# EAGLE design usbHub (EAGLE 9.5.2)
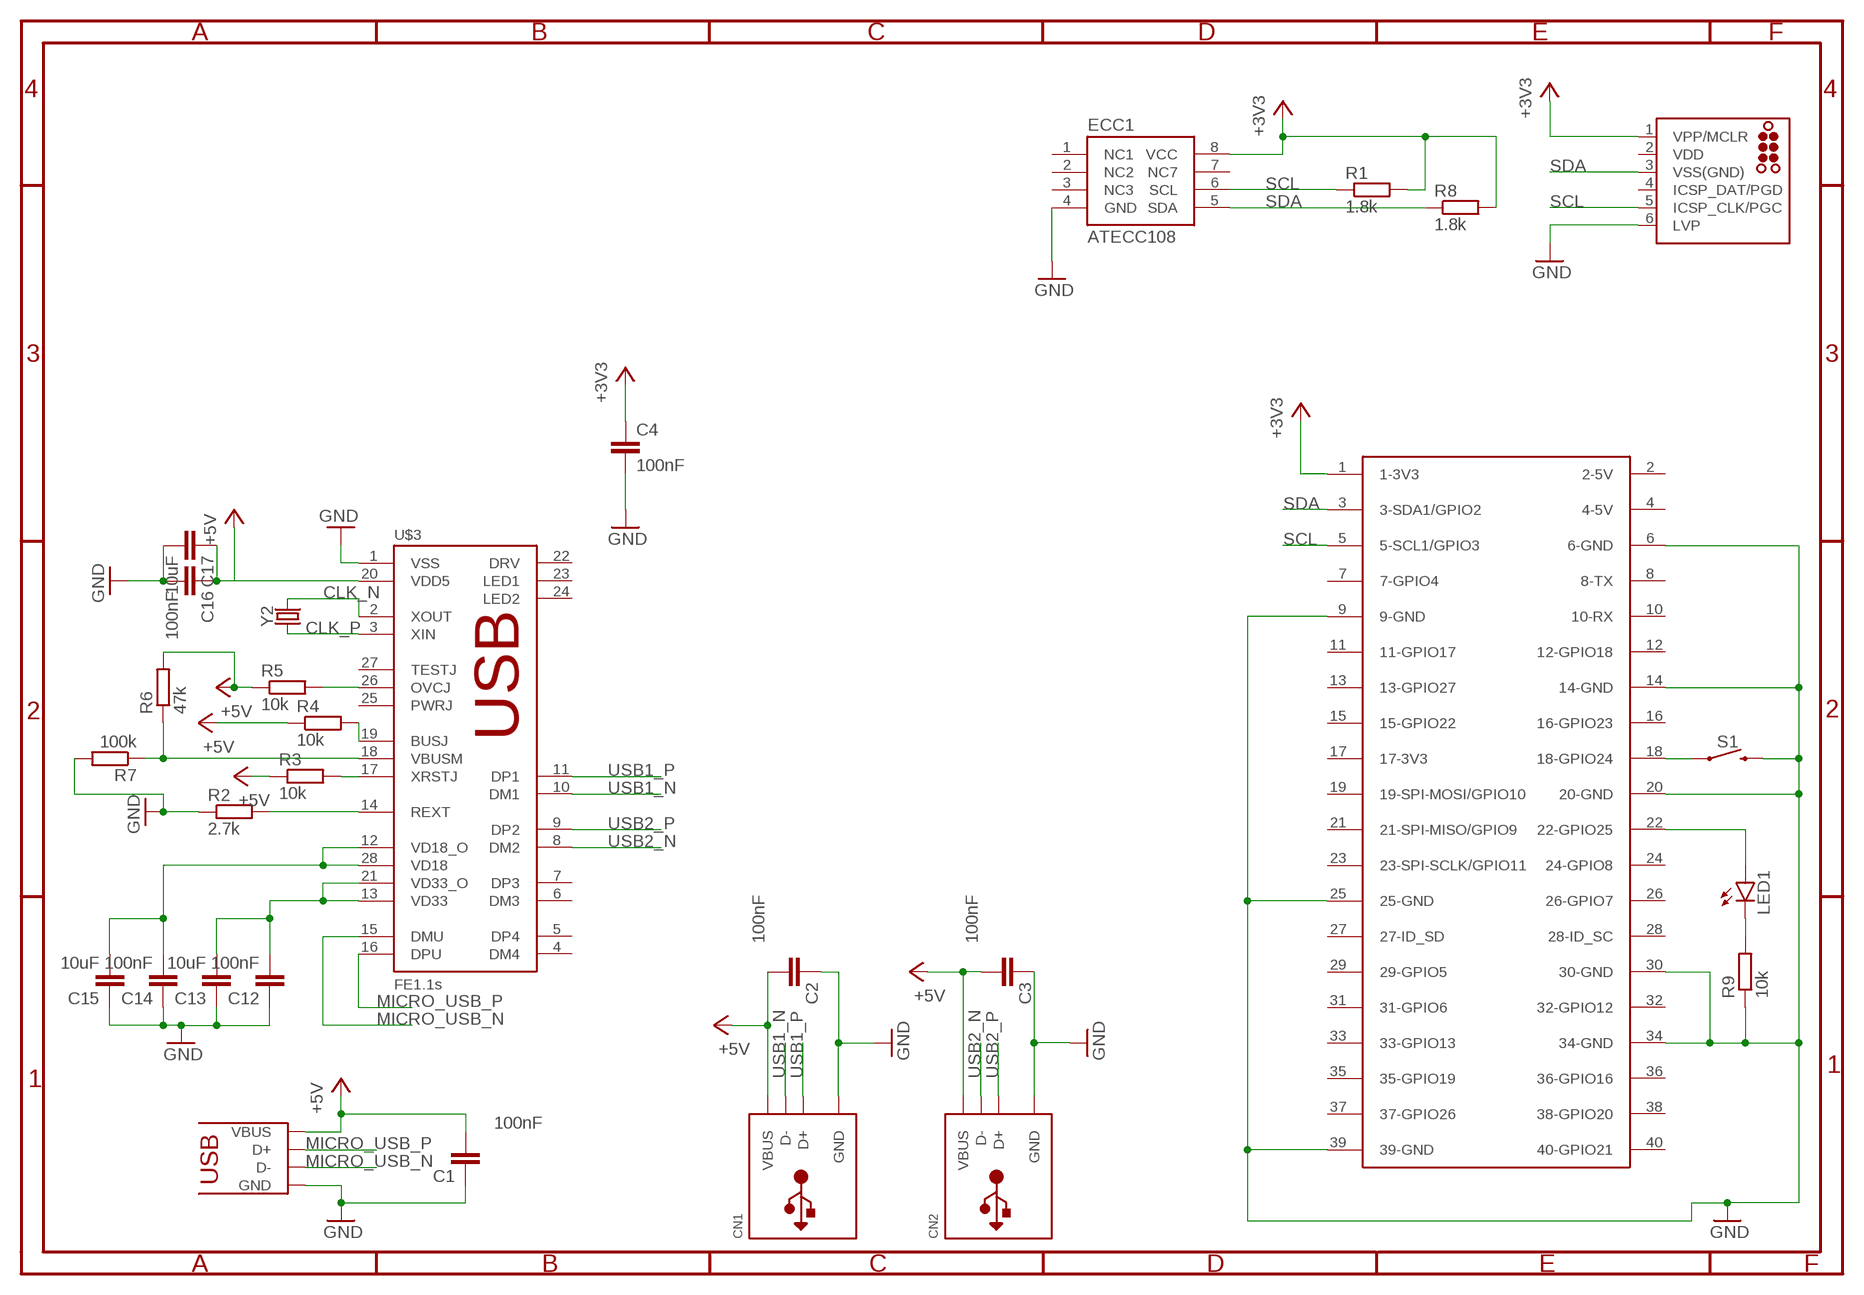
[diagram p0: schematic, sheet 1]

## Parts
C1  100nF  C-EUC0603  [C0603]
C2  100nF  C-EUC0603  [C0603]
C3  100nF  C-EUC0603  [C0603]
C4  100nF  C-EUC0603  [C0603]
C12  100nF  C-EUC0603  [C0603]
C13  10uF  C-EUC0603  [C0603]
C14  100nF  C-EUC0603  [C0603]
C15  10uF  C-EUC0603  [C0603]
C16  100nF  C-EUC0603  [C0603]
C17  10uF  C-EUC0603  [C0603]
CN1  USB_TYPEAPTHFML  [USB_HOST-PTH]
CN2  USB_TYPEAPTHFML  [USB_HOST-PTH]
ECC1  ATECC108  [SO08]
J1  TC2030-MCP-NL  [TC2030-MCP-NL]
LED1  LEDCHIPLED_0603  [CHIPLED_0603]
R1  1.8k  R-EU_R0603  [R0603]
R2  2.7k  R-EU_R0603  [R0603]
R3  10k  R-EU_R0603  [R0603]
R4  10k  R-EU_R0603  [R0603]
R5  10k  R-EU_R0603  [R0603]
R6  47k  R-EU_R0603  [R0603]
R7  100k  R-EU_R0603  [R0603]
R8  1.8k  R-EU_R0603  [R0603]
R9  10k  R-EU_R0603  [R0603]
S1  MOMENTARY-SWITCH-SPST-SMD-6.2MM-TALL  [TACTILE_SWITCH_SMD_6.2MM_TALL]
U$1  USB-MICROB  [USB-MICROB]
U$3  FE1.1S  [FE1.1S_SSOP-28]
U$4  RASPBERRY-PI+HEADERONLY  [RASPBERRY-PI-PLUS-HEADERONLY]
Y2  12mHZ  CRYSTALSMD-HC49UP  [HC49UP]

## Nets
+3V3: C4.1 ECC1.8(VCC) J1.1(VPP/MCLR) R1.2 R8.2 U$4.1(1-3V3)
+5V: C1.2 C2.2 C3.2 C16.1 C17.1 CN1.VBUS CN2.VBUS R3.1 R4.1 R5.1 R6.2 U$1.VBUS U$3.20(VDD5)
CLK_N: U$3.2(XOUT) Y2.2
CLK_P: U$3.3(XIN) Y2.1
GND: C1.1 C2.1 C3.1 C4.2 C12.1 C13.1 C14.1 C15.1 C16.2 C17.2 CN1.GND CN2.GND ECC1.4(GND) J1.6(LVP) R2.1 R7.2 R9.1 S1.B2 U$1.GND U$1.MT1(GND) U$1.MT2(GND) U$1.P$1(GND) U$1.P$2(GND) U$1.P$3(GND) U$1.P$4(GND) U$3.1(VSS) U$4.6(6-GND) U$4.9(9-GND) U$4.14(14-GND) U$4.20(20-GND) U$4.25(25-GND) U$4.30(30-GND) U$4.34(34-GND) U$4.39(39-GND)
MICRO_USB_N: U$1.D- U$3.15(DMU)
MICRO_USB_P: U$1.D+ U$3.16(DPU)
N$1: LED1.A U$4.22(22-GPIO25)
N$3: S1.A2 U$4.18(18-GPIO24)
N$5: LED1.C R9.2
N$11: C12.2 C13.2 U$3.13(VD33) U$3.21(VD33_O)
N$12: C14.2 C15.2 U$3.12(VD18_O) U$3.28(VD18)
N$19: R5.2 U$3.26(OVCJ)
N$20: R2.2 U$3.14(REXT)
N$21: R4.2 U$3.19(BUSJ)
N$22: R6.1 R7.1 U$3.18(VBUSM)
N$24: R3.2 U$3.17(XRSTJ)
SCL: ECC1.6(SCL) J1.5(ICSP_CLK/PGC) R1.1 U$4.5(5-SCL1/GPIO3)
SDA: ECC1.5(SDA) J1.3(VSS(GND)) R8.1 U$4.3(3-SDA1/GPIO2)
USB1_N: CN1.D- U$3.10(DM1)
USB1_P: CN1.D+ U$3.11(DP1)
USB2_N: CN2.D- U$3.8(DM2)
USB2_P: CN2.D+ U$3.9(DP2)
Unconnected: ECC1.1(NC1) ECC1.2(NC2) ECC1.3(NC3) ECC1.7(NC7) J1.4(ICSP_DAT/PGD) U$3.4(DM4) U$3.5(DP4) U$3.6(DM3) U$3.7(DP3) U$3.22(DRV) U$3.23(LED1) U$3.24(LED2) U$3.25(PWRJ) U$3.27(TESTJ) U$4.2(2-5V) U$4.4(4-5V) U$4.7(7-GPIO4) U$4.8(8-TX) U$4.10(10-RX) U$4.11(11-GPIO17) U$4.12(12-GPIO18) U$4.13(13-GPIO27) U$4.15(15-GPIO22) U$4.16(16-GPIO23) U$4.17(17-3V3) U$4.19(19-SPI-MOSI/GPIO10) U$4.21(21-SPI-MISO/GPIO9) U$4.23(23-SPI-SCLK/GPIO11) U$4.24(24-GPIO8) U$4.26(26-GPIO7) U$4.27(27-ID_SD) U$4.28(28-ID_SC) U$4.29(29-GPIO5) U$4.31(31-GPIO6) U$4.32(32-GPIO12) U$4.33(33-GPIO13) U$4.35(35-GPIO19) U$4.36(36-GPIO16) U$4.37(37-GPIO26) U$4.38(38-GPIO20) U$4.40(40-GPIO21)

## Notes on the sheet
- USB

## Power pins joined to a net without a drawn wire
VDD: J1.2(VDD)

## Library data of the parts
C1-C4 C12-C17 = resistor:C-EU: CAPACITOR, European symbol
CN1 CN2 = microbuilder:USB_TYPEA: USB - Type A Connectors Male types stick out and are inserted into a PC or matching females parts (these are the connectors used on USB Memory Sticks, etc.). Female parts are generally used for USB Host and accept a male-type connector. SMT Male - 4UCON: 10017 PTH Female - Digikey: 609-1045-ND, 4UCon: 05241
ECC1 = SparkFun-IC-Special-Function:ATECC108: ATECC108 ECDSA with NIST ATECC108: Provides ECDSA with NIST curves P256, B283, and K283. Also, a RNG, 8.5Kb EEPROM. 2.0V - 5.5V. Datasheet <https://cdn.sparkfun.com/datasheets/Dev/Beagle/Atmel-8873S-CryptoAuth-ATECC108-Datasheet-Summary.pdf> SparkFun Products CryptoCape <https://www.sparkfun.com/products/12773> (DEV-12773) SparkFun CryptoShield <https://www.sparkfun.com/products/13183> (DEV-13183); PROD_ID: IC-11982
J1 = tag-connect:TC2030: TAG-CONNECT ICSP Connector Manufacturer: Tag-Connect <http://www.tag-connect.com> Cable for easy In-Circuit Serial Programming. Designed for Microchip ICD2, suitable for many others. Two variants - one "with legs" (for hands-free fit on PCB) and another "without legs" for quick programming. PAD Description 1 MCLR/Vpp 2 Vdd 3 GND 4 PGD (ISPDAT) 5 PGC (ISPCLK) 6 nc (used for LVP) ©2009 ROFA.cz - modified and updated by Robert Darlington ‹rdarlington@gmail.com›
LED1 = led:LED: LED OSRAM: - CHIPLED LG R971, LG N971, LY N971, LG Q971, LY Q971, LO R971, LY R971 LH N974, LH R974 LS Q976, LO Q976, LY Q976 LO Q996 - Hyper CHIPLED LW Q18S LB Q993, LB Q99A, LB R99A - SideLED LS A670, LO A670, LY A670, LG A670, LP A670 LB A673, LV A673, LT A673, LW A673 LH A674 LY A675 LS A676, LA A676, LO A676, LY A676, LW A676 LS A679, LY A679, LG A679 - Hyper Micro SIDELED® LS Y876, LA Y876, LO Y876, LY Y876 LT Y87S - SmartLED LW L88C, LW L88S LB L89C, LB L89S, LG L890 LS L89K, LO L89K, LY L89K LS L896, LA L896, LO L896, LY L896 - TOPLED LS T670, LO T670, LY T670, LG T670, LP T670 LSG T670, LSP T670, LSY T670, LOP T670, LYG T670 LG T671, LOG T671, LSG T671 LB T673, LV T673, LT T673, LW T673 LH T674 LS T676, LA T676, LO T676, LY T676, LB T676, LH T676, LSB T676, LW T676 LB T67C, LV T67C, LT T67C, LS T67K, LO T67K, LY T67K, LW E67C LS E67B, LA E67B, LO E67B, LY E67B, LB E67C, LV E67C, LT E67C LW T67C LS T679, LY T679, LG T679 LS T770, LO T770, LY T770, LG T770, LP T770 LB T773, LV T773, LT T773, LW T773 LH T774 LS E675, LA E675, LY E675, LS T675 LS T776, LA T776, LO T776, LY T776, LB T776 LHGB T686 LT T68C, LB T68C - Hyper Mini TOPLED® LB M676 - Mini TOPLED Santana® LG M470 LS M47K, LO M47K, LY M47K Source: http://www.osram.convergy.de LUXEON: - LUMILED® LXK2-PW12-R00, LXK2-PW12-S00, LXK2-PW14-U00, LXK2-PW14-V00 LXK2-PM12-R00, LXK2-PM12-S00, LXK2-PM14-U00 LXK2-PE12-Q00, LXK2-PE12-R00, LXK2-PE12-S00, LXK2-PE14-T00, LXK2-PE14-U00 LXK2-PB12-K00, LXK2-PB12-L00, LXK2-PB12-M00, LXK2-PB14-N00, LXK2-PB14-P00, LXK2-PB14-Q00 LXK2-PR12-L00, LXK2-PR12-M00, LXK2-PR14-Q00, LXK2-PR14-R00 LXK2-PD12-Q00, LXK2-PD12-R00, LXK2-PD12-S00 LXK2-PH12-R00, LXK2-PH12-S00 LXK2-PL12-P00, LXK2-PL12-Q00, LXK2-PL12-R00 Source: www.luxeon.com KINGBRIGHT: KA-3528ASYC Source: www.kingbright.com
R1-R9 = resistor:R-EU_: RESISTOR, European symbol
S1 = SparkFun-Switches:MOMENTARY-SWITCH-SPST: Momentary Switch (Pushbutton) - SPST Normally-open (NO) SPST momentary switches (buttons, pushbuttons). Variants PTH-12MM - 12mm square, through-hole Momentary Pushbutton Switch - 12mm Square <https://www.sparkfun.com/products/9190> (COM-09190) PTH-6.0MM, PTH-6.0MM-KIT - 6.0mm square, through-hole Mini Pushbutton Switch <https://www.sparkfun.com/products/97> (COM-00097) KIT package intended for soldering kit's - only one side of pads' copper is exposed. PTH-RIGHT-ANGLE-KIT - Right-angle, through-hole Right Angle Tactile Button <https://www.sparkfun.com/products/10791> - Used on SparkFun BigTime Watch Kit <https://www.sparkfun.com/products/11734> SMD-12MM - 12mm square, surface-mount Tactile Button - SMD (12mm) <https://www.sparkfun.com/products/12993> (COM-12993) Used on SparkFun PicoBoard <https://www.sparkfun.com/products/11888> SMD-4.5MM - 4.5mm Square Trackball Switch Used on SparkFun Blackberry Trackballer Breakout <https://www.sparkfun.com/products/13169> SMD-4.6MMX2.8MM - 4.60mm x 2.80mm, surface mount Used on SparkFun SAMD21 Mini Breakout <https://www.sparkfun.com/products/13664> SMD-5.2MM, SMD-5.2-REDUNDANT - 5.2mm square, surface-mount Mini Pushbutton Switch - SMD <https://www.sparkfun.com/products/8720> (COM-08720) Used on Arduino Pro Mini <https://www.sparkfun.com/products/11114> REDUNDANT package connects both switch circuits together SMD-6.0X3.5MM - 6.0 x 3.5mm, surface mount Momentary Reset Switch SMD <https://www.sparkfun.com/products/8229> (COM-08229) SMD-6.2MM-TALL - 6.2mm square, surface mount Tactile Button - SMD (6mm) <https://www.sparkfun.com/products/12992> Used on SparkFun Digital Sandbox <https://www.sparkfun.com/products/12651> SMD-RIGHT-ANGLE - Right-angle, surface mount Used on SparkFun Block for Intel® Edison - Arduino <https://www.sparkfun.com/products/13036>; PROD_ID: SWCH-11966; SF_SKU: COM-12992
U$1 = pimoroni:USB-MICROB
U$3 = Ai_IC:FE1.1S
U$4 = Ava2:RASPBERRY-PI+: Samtec SSW-120-01-T-D
Y2 = SparkFun-Clocks:CRYSTAL: Crystals (Generic) These are passive quartz crystals, which can be used as a clock source for a microcontroller. Crystal's are two-terminal devices. They require external "load" capacitors to generate an oscillating signal.

## Board
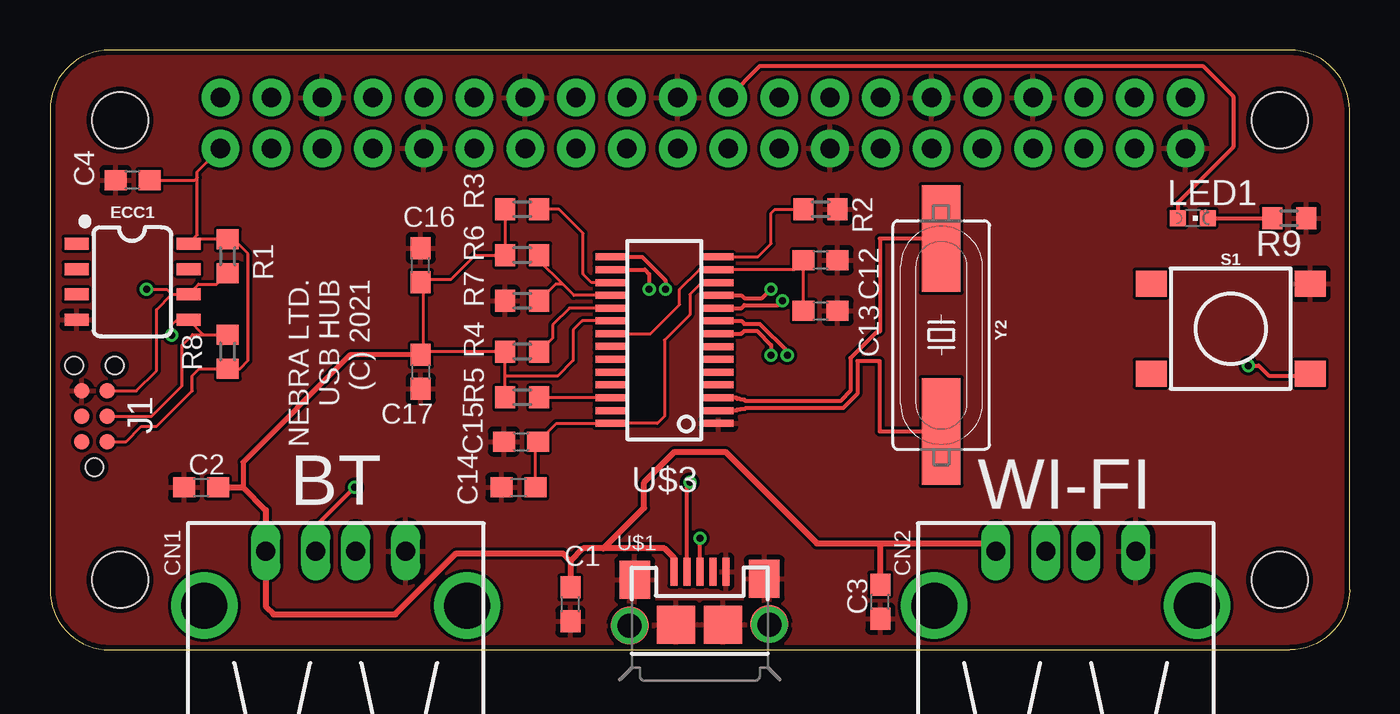
[diagram p1: board, top side]
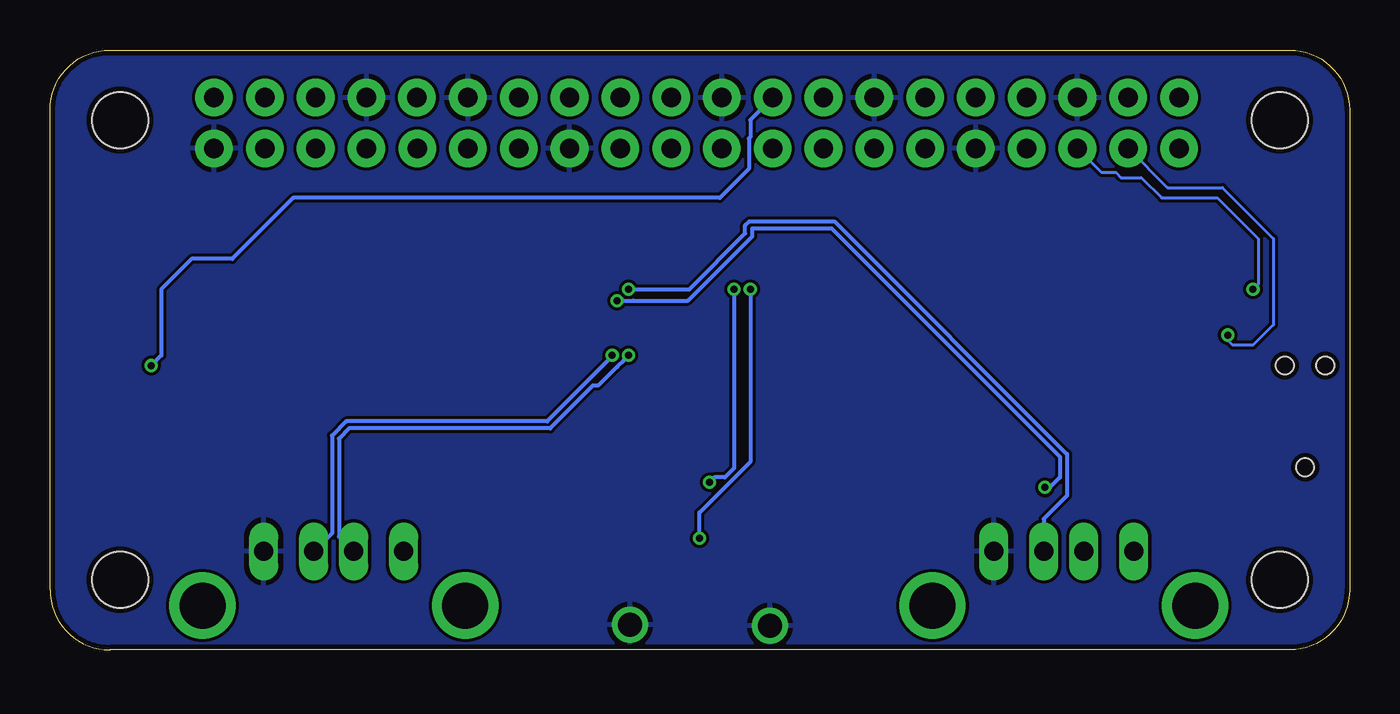
[diagram p2: board, bottom side, seen from below]

Size 65 x 30 mm. Coordinates in mm from the lower left corner, seen from the top.
Outline: 3,0 62,0 arc90 65,3 65,27 arc90 62,30 3,30 arc90 0,27 0,3 arc90 3,0
Copper layers (1*16): Top 0.035mm / dielectric 1.5mm / Bottom 0.035mm
Design rules "dirt_cheap_dirty_boards.v1.1": minimum track width 6mil, minimum drill 12mil, track to track 6mil, track to pad 6mil, pad to pad 6mil, via to via 6mil, smd to smd 0mil, copper to edge 10mil, drill to drill 10mil, minimum pad ring 10mil, minimum via ring 6mil, stop-mask expansion 2mil, vias tented up to drill 25mil, thermal gap 10mil
Holes 2.8 mm at 3.5,26.5 61.5,26.5 3.5,3.5 61.5,3.5

### Footprints (pad centres in the part's own frame; a part is rotated, then mirrored left to right if it is on the bottom)
C0603 = smd 1.1 x 1: 1 -0.85,0; 2 0.85,0
USB_HOST-PTH = drill 0.95 long: D+ 1,6.52; D- -1,6.52; GND 3.5,6.52; VBUS -3.5,6.52 | drill 2.3 pad 2.9: S1 -6.57,3.81; S2 6.57,3.81
SO08 = smd 0.6 x 1.2: 1 -1.905,-2.8; 2 -0.635,-2.8; 3 0.635,-2.8; 4 1.905,-2.8; 5 1.905,2.8; 6 0.635,2.8; 7 -0.635,2.8; 8 -1.905,2.8
TC2030-MCP-NL = smd 0.787 x 0.787: 1 1.27,-0.635; 2 1.27,0.635; 3 2.54,-0.635; 4 2.54,0.635; 5 3.81,-0.635; 6 3.81,0.635 | hole 0.889: 0,0; 5.08,-1.016; 5.08,1.016
CHIPLED_0603 = smd 0.8 x 0.8: A 0,-0.75; C 0,0.75
R0603 = smd 1 x 1.1: 1 -0.85,0; 2 0.85,0
TACTILE_SWITCH_SMD_6.2MM_TALL = smd 1.55 x 1.3: A1 -3.975,-2.25; A2 3.975,-2.25; B1 -3.975,2.25; B2 3.975,2.25
USB-MICROB = smd 0.35 x 1.4: D+ 0,2.65; D- -0.65,2.65; GND 1.3,2.65; ID 0.65,2.65; VBUS -1.3,2.65 | smd 1.546 x 1.9: MT1 -3.251,2.235; MT2 3.226,2.286 | smd 1.9 x 1.9: P$1 -1.194,0; P$2 1.168,0; P$5 -3.505,-0.051; P$6 3.48,0.025 | drill 1.2 pad 1.6: P$3 -3.505,-0.051; P$4 3.48,0
FE1.1S_SSOP-28 = smd 0.35 x 1.5: 1 -4.16,-2.7; 2 -3.52,-2.7; 3 -2.88,-2.7; 4 -2.24,-2.7; 5 -1.6,-2.7; 6 -0.96,-2.7; 7 -0.32,-2.7; 8 0.32,-2.7; 9 0.96,-2.7; 10 1.6,-2.7; 11 2.24,-2.7; 12 2.88,-2.7; 13 3.52,-2.7; 14 4.16,-2.7; 15 4.16,2.7; 16 3.52,2.7; 17 2.88,2.7; 18 2.24,2.7; 19 1.6,2.7; 20 0.96,2.7; 21 0.32,2.7; 22 -0.3,2.7; 23 -0.96,2.7; 24 -1.6,2.7; 25 -2.24,2.7; 26 -2.88,2.7; 27 -3.52,2.7; 28 -4.16,2.7
RASPBERRY-PI-PLUS-HEADERONLY = drill 0.97 pad 1.88: 1 -23.97,-1.218; 2 -23.97,1.323; 3 -21.43,-1.218; 4 -21.43,1.323; 5 -18.89,-1.218; 6 -18.89,1.323; 7 -16.35,-1.218; 8 -16.35,1.323; 9 -13.81,-1.218; 10 -13.81,1.323; 11 -11.27,-1.218; 12 -11.27,1.323; 13 -8.73,-1.218; 14 -8.73,1.323; 15 -6.19,-1.218; 16 -6.19,1.323; 17 -3.65,-1.218; 18 -3.65,1.323; 19 -1.11,-1.218; 20 -1.11,1.323; 21 1.43,-1.218; 22 1.43,1.323; 23 3.97,-1.218; 24 3.97,1.323; 25 6.51,-1.218; 26 6.51,1.323; 27 9.05,-1.218; 28 9.05,1.323; 29 11.59,-1.218; 30 11.59,1.323; 31 14.13,-1.218; 32 14.14,1.323; 33 16.67,-1.218; 34 16.67,1.323; 35 19.21,-1.218; 36 19.21,1.323; 37 21.75,-1.218; 38 21.75,1.323; 39 24.29,-1.218; 40 24.29,1.323
HC49UP = smd 5.334 x 1.93: 1 -4.826,0; 2 4.826,0

### Placement (x,y rotation side)
C1  26.04,2.28 90 top
C2  7.56,8.12 0 top
C3  41.53,2.41 90 top
C4  4.13,23.49 180 top
C12  38.55,19.49 180 top
C13  38.55,16.95 180 top
C14  23.43,8.12 0 top
C15  23.56,10.41 0 top
C16  18.54,19.24 90 top
C17  18.54,13.9 270 top
CN1  14.29,-1.59 0 top
CN2  50.8,-1.59 0 top
ECC1  4.13,18.41 270 top
J1  2.22,9.14 90 top
LED1  57.15,21.59 270 top
R1  8.89,19.68 90 top
R2  38.55,22.03 180 top
R3  23.62,22.03 0 top
R4  23.62,14.92 0 top
R5  23.62,12.63 0 top
R6  23.62,19.74 180 top
R7  23.62,17.46 180 top
R8  8.89,14.92 270 top
R9  61.98,21.59 180 top
S1  59.06,16.06 0 top
U$1  32.5,1.27 0 top
U$3  30.73,15.49 90 top
U$4  32.5,26.3 0 top
Y2  44.58,15.74 270 top

### Tracks (layer width: path | path; a pad name or v marks a point on that pad's centre or on a via)
+3V3
  Top 0.152: J1.1 3.81,10.41 4.57,11.17 5.33,11.17 7.11,12.95 7.11,13.71 7.47,14.07 R8.2 9.5,14.07 9.91,14.47 9.91,19.81 9.18,20.53 R1.2 7.14,20.53 ECC1.8 7.37,20.75 7.37,23.62 | U$4.1 7.37,23.91 7.37,23.62 | C4.1 7.24,23.49 7.37,23.62
+5V
  Top 0.152: R5.1 22.77,13.71 | 22.77,13.71 R4.1 18.71,14.92 18.66,14.87 | 22.77,13.71 25.4,13.71 26.16,14.47 26.16,16 26.61,16.45 U$3.20 | R3.1 R6.2 21.27,19.74 20.07,18.54 18.69,18.54 C16.1 18.66,18.27 18.66,14.87 | 18.66,14.87 C17.1
  Top 0.254: C17.1 15.01,14.75 9.65,9.39 9.65,8.12
  Top 0.305: U$1.VBUS 31.2,4.61 30.73,5.08 27.69,5.08 | 27.69,5.08 26.67,5.08 26.04,4.44 | 26.04,4.44 C1.2 | C2.2 9.65,8.12 10.79,6.99 CN1.VBUS 10.79,2.16 11.18,1.77 17.27,1.77 20.32,4.82 25.65,4.82 26.04,4.44 | 27.69,5.08 29.72,7.11 29.72,8.38 31.24,9.9 33.78,9.9 38.35,5.33 41.4,5.33 | CN2.VBUS 46.9,5.33 41.4,5.33 | C3.2 41.53,5.2 41.4,5.33
CLK_N
  Top 0.2: Y2.2 41.51,10.92 41.51,14.44 40.39,14.44 40.39,12.8 39.67,12.09 34.8,12.09 34.75,12.04 34.55,12.04 34.52,12.01 34.38,12.01 34.35,11.97 U$3.2
CLK_P
  Top 0.2: Y2.1 41.51,20.57 41.51,15.92 41.36,15.92 40.03,14.59 40.03,12.95 39.53,12.44 34.8,12.44 34.73,12.51 34.55,12.51 34.5,12.55 34.38,12.55 34.33,12.61 U$3.3
GND
  pour Top: -7.62,-3.18 -7.62,39.68 -6.98,40.32 -3.81,43.49 63.5,43.49 68.26,38.73 68.26,18.73 68.26,-6.67 63.5,-11.43 0.64,-11.43
  pour Bottom: -7.3,-3.18 -7.3,39.68 -6.67,40.32 -3.49,43.49 63.82,43.49 68.58,38.73 68.58,18.73 68.58,-6.67 63.82,-11.43 0.95,-11.43
MICRO_USB_N  (via drill 0.35)
  Top 0.2: U$3.15 29.61,19.65 30.78,18.48 v30.78,18.03 | U$1.D- 31.85,8.22 v32,8.38
  Bottom 0.2: v30.78,18.03 30.78,9.09 31.24,8.63 31.75,8.63 v32,8.38
MICRO_USB_P  (via drill 0.35)
  Top 0.2: U$3.16 29.75,19.01 29.97,18.79 v29.97,18.03 | U$1.D+ 32.5,5.57 v32.51,5.58
  Bottom 0.2: v29.97,18.03 29.97,9.4 32.51,6.86 v32.51,5.58
N$1
  Top 0.2: U$4.22 35.52,29.21 57.66,29.21 59.18,27.68 59.18,25.14 56.4,22.36 LED1.A
N$3  (via drill 0.35)
  Top 0.2: v59.94,14.22 60.45,14.22 60.96,13.71 62.93,13.71 S1.A2
  Bottom 0.2: U$4.18 29.97,26.5 29.97,25.64 30.04,25.57 30.04,24.06 31.5,22.6 52.83,22.6 55.88,19.55 57.91,19.55 59.44,18.03 59.44,14.73 v59.94,14.22
N$5
  Top 0.2: LED1.C R9.2
N$11
  Top 0.152: U$3.21 30.04,15.81 31.5,17.27 31.5,18.03 32.48,19.01 U$3.13 33.47,19.05 37.25,19.05 C12.2 C13.2
N$12
  Top 0.152: U$3.12 32.6,18.37 32,17.78 32,16.76 30.73,15.49 30.73,11.68 30.38,11.33 U$3.28 25.33,11.33 C15.2 24.28,10.28 C14.2
N$19
  Top 0.152: R5.2 28.01,12.63 U$3.26
N$20
  Top 0.152: U$3.14 35.4,19.65 36.07,20.32 36.07,21.84 36.26,22.03 R2.2
N$21
  Top 0.152: U$3.19 25.98,17.09 25.15,16.25 25.15,15.59 R4.2
N$22
  Top 0.152: U$3.18 26.21,17.73 25.65,18.28 | R6.1 24.47,19.47 25.65,18.28 | 25.65,18.28 25.3,18.28 R7.1
N$24
  Top 0.152: U$3.17 27.09,18.37 26.67,18.79 26.67,20.82 25.46,22.03 R3.2
SCL  (via drill 0.35)
  Top 0.152: R1.1 8.34,18.28 7.44,18.28 ECC1.6 6.1,17.78 | J1.5 4.32,12.95 5.33,13.97 5.33,17.01 6.1,17.78 | v4.83,18.03 5.84,18.03 6.1,17.78
  Bottom 0.152: U$4.5 12.4,23.87 11.68,23.87 11.43,23.62 10.41,23.62 9.4,22.6 6.6,22.6 4.57,20.57 4.57,18.28 v4.83,18.03
SDA  (via drill 0.35)
  Top 0.152: 7.67,15.77 ECC1.5 6.35,16.51 6.1,16.25 v6.1,15.74 | 7.67,15.77 R8.1 | J1.3 5.08,11.68 6.6,13.2 6.6,15.24 7.14,15.77 7.67,15.77
  Bottom 0.152: U$4.3 9.1,23.11 6.35,23.11 3.81,20.57 3.81,16.25 4.83,15.24 5.84,15.24 6.1,15.49 v6.1,15.74
USB1_N  (via drill 0.35)
  Top 0.2: U$3.10 34.58,17.09 34.73,17.23 36.41,17.23 v36.64,17.46 | v15.24,8.12 13.29,6.17 CN1.D-
  Bottom 0.2: v36.64,17.46 36.32,17.46 36.31,17.45 35.83,17.45 35.82,17.46 33.09,17.46 29.87,20.68 29.87,21.08 25.91,21.08 14.48,9.65 14.48,8.63 14.99,8.12 v15.24,8.12
USB1_P  (via drill 0.35)
  Top 0.2: U$3.11 34.58,17.73 34.73,17.59 35.62,17.59 v36.07,18.03
  Bottom 0.2: v36.07,18.03 33.02,18.03 30.23,20.82 30.23,21.22 30.02,21.43 25.76,21.43 14.13,9.79 14.13,7.71 15.29,6.55 CN1.D+
USB2_N  (via drill 0.35)
  Top 0.2: U$3.8 34.58,15.81 34.73,15.95 35.35,15.95 36.07,15.24 v36.07,14.73
  Bottom 0.2: v36.07,14.73 36.3,14.5 36.3,14.49 36.64,14.15 36.65,14.15 37.59,13.21 37.85,13.21 39.99,11.07 50.04,11.07 50.55,10.57 50.55,5.67 CN2.D-
USB2_P  (via drill 0.35)
  Top 0.2: U$3.9 34.58,16.45 34.73,16.31 35.5,16.31 36.88,14.93 v36.88,14.73
  Bottom 0.2: v36.88,14.73 36.88,14.68 40.13,11.43 50.18,11.43 50.9,10.71 50.9,5.83 CN2.D+

### Text on the board
tNames: NEBRA LTD. / USB HUB / (C) 2021 | BT | WI-FI